# EAGLE schematic badge1 (EAGLE 7.3.0)
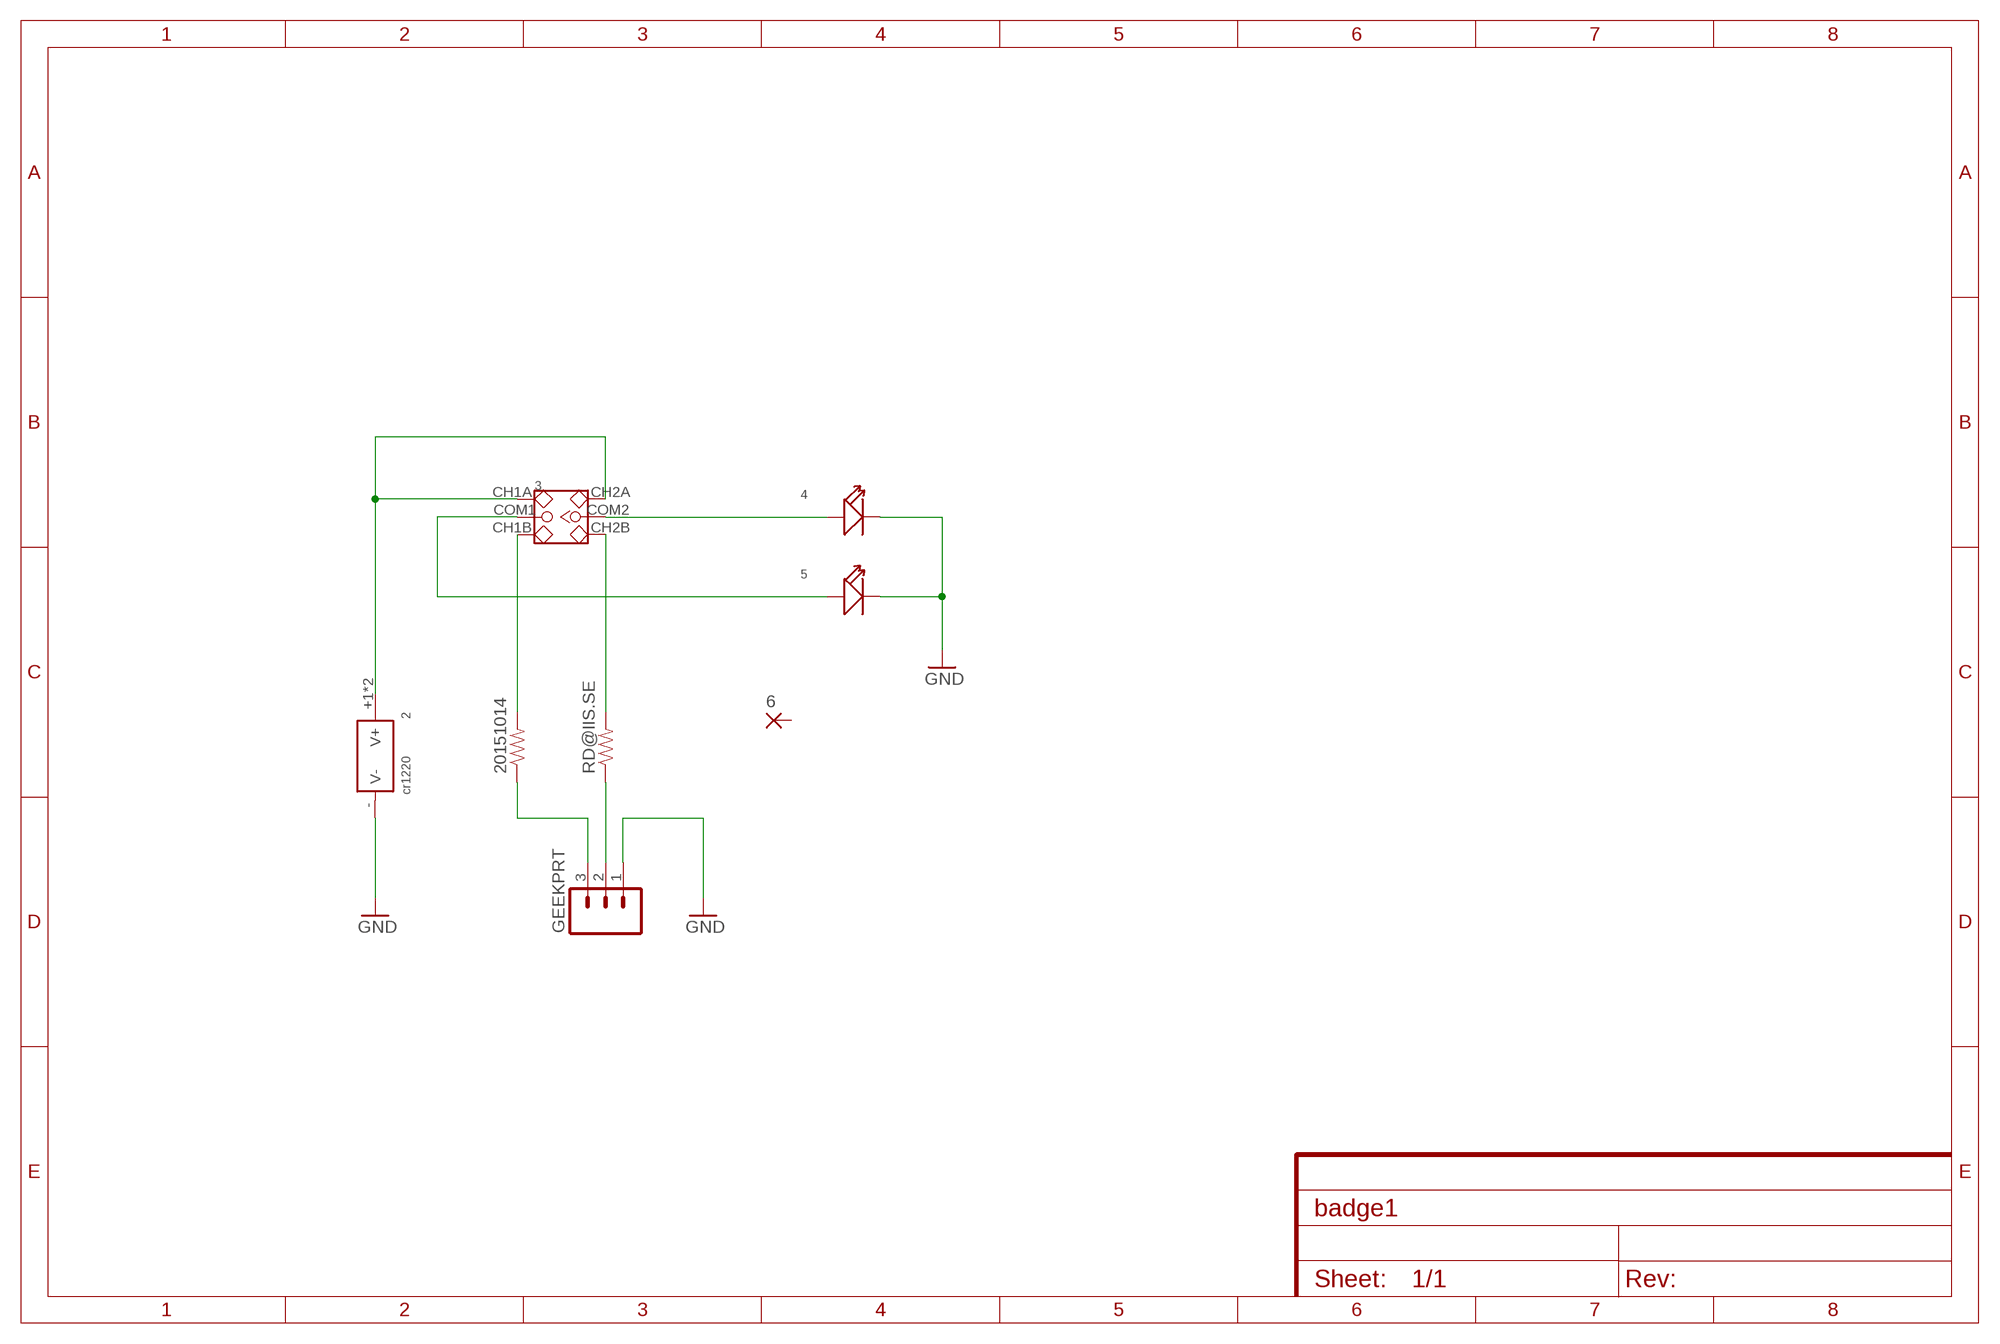
[diagram p0: schematic, sheet 1]

## Parts
2  cr1220  DIP-BATTERY-CELL-HOLDER(1220)  [BAT2P-13.5-CR1220]
3  DIP-TOGGLE-SWITCH-2CH-(2X3P-2.54-90D)'90D'  [SW6-2.54-9.0X3.5X3.2MM-90D]
4  LED'5MM'  [LED2-2.54-D5.0MM]
5  LED'5MM'  [LED2-2.54-D5.0MM]
6  3,81/1,4  [3,81/1,4]
20151014  RESISTORPTH-1/4W  [AXIAL-0.4]
GEEKPRT  M03LOCK  [1X03_LOCK]
RD@IIS.SE  RESISTORPTH-1/4W  [AXIAL-0.4]

## Nets
GND: 2.-(V-) 4.- 5.- GEEKPRT.1
N$1: 3.COM2 4.+
N$2: 3.COM1 5.+
N$3: 2.+1(V+) 2.+2(V+) 3.CH1A 3.CH2A
N$4: GEEKPRT.2 RD@IIS.SE.P$1
N$5: 3.CH1B 20151014.P$2
N$6: 3.CH2B RD@IIS.SE.P$2
N$7: 20151014.P$1 GEEKPRT.3
Unconnected: 6.1(P)

## Library data of the parts
2 = Seeed-OPL-Connector:DIP-BATTERY-CELL-HOLDER(1220): 320170002
3 = Seeed-OPL-Switch:DIP-TOGGLE-SWITCH-2CH-(2X3P-2.54-90D): 311030004
4 5 = Discrete-new:LED
6 = wirepad:3,81/1,4: THROUGH-HOLE PAD
20151014 RD@IIS.SE = SparkFun-Passives:RESISTOR: Resistor Basic schematic elements and footprints for 0603, 1206, and PTH resistors.
GEEKPRT = SparkFun-Connectors:M03: Header 3 Standard 3-pin 0.1" header. Use with straight break away headers (SKU : PRT-00116), right angle break away headers (PRT-00553), swiss pins (PRT-00743), machine pins (PRT-00117), and female headers (PRT-00115). Molex polarized connector foot print use with SKU : PRT-08232 with associated crimp pins and housings.